# Altium schematic sheet Master MicroController Port C.SchDoc: Master Micro Controller Port C Pin Out
size A4; DocumentNumber: 18; SheetNumber: 18; SheetTotal: 54
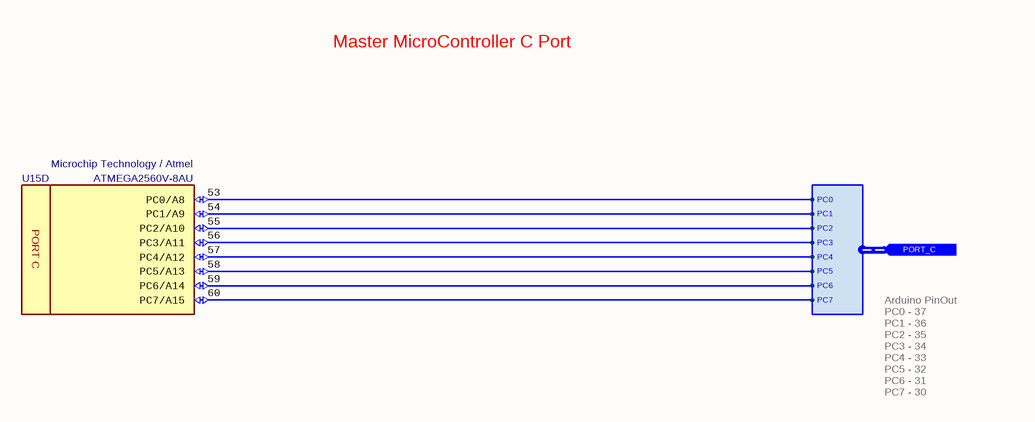
[diagram p0: Master MicroController Port C.SchDoc]

## Parts
U15  Manufacturer_Part_Number: ATMEGA2560V-8AU  Manufacturer_Name: Microchip Technology / Atmel  [TQFP100]  (hidden comment: 8-bit MicroController)  (part D of 15)

## Ports
PORT_C (in, harness PORT_C)

## Harnesses
PORT_C: PC0, PC1, PC2, PC3, PC4, PC5, PC7, PC6

## Nets
NetU15_53: U15.53(PC0/A8) ; port PORT_C.PC0
NetU15_54: U15.54(PC1/A9) ; port PORT_C.PC1
NetU15_55: U15.55(PC2/A10) ; port PORT_C.PC2
NetU15_56: U15.56(PC3/A11) ; port PORT_C.PC3
NetU15_57: U15.57(PC4/A12) ; port PORT_C.PC4
NetU15_58: U15.58(PC5/A13) ; port PORT_C.PC5
NetU15_59: U15.59(PC6/A14) ; port PORT_C.PC6
NetU15_60: U15.60(PC7/A15) ; port PORT_C.PC7

## Notes on the sheet
- Master MicroController C Port
- Arduino PinOut
  PC0 - 37
  PC1 - 36
  PC2 - 35
  PC3 - 34
  PC4 - 33
  PC5 - 32
  PC6 - 31
  PC7 - 30
- Engineer
- All Rights are reserved to Customer and Engineer. [2021]
- Size:
- Date:
- A4
- Project :
- Time:
- Sheet
- of
- Customer
- Product ID
- Module ID
- Version
- File:
- Revision
- (in symbol IC - ATMEGA2560V-8AU, part D) PORT C

## Library data of the parts
U15 = IC - ATMEGA2560V-8AU: 8-bit Microcontrollers - MCU 256kB Flash 4kB EEPROM 86 I/O Pins; Supply Voltage - Min: 2V7; Supply Voltage - Max: 5.5V; Height: 1mm; Mouser_Part_Number: 556-ATMEGA2560V8AU; ComponentLink1Description: DataSheet; ComponentLink1URL: https://eu.mouser.com/datasheet/2/268/Atmel-2549-8-bit-AVR-Microcontroller-ATmega640-128-1315286.pdf; ROHS: Yes; Minimum Operating Temperature: -40; Maximum Operating Temperature: +85; ComponentLink2Description: Mouser; ComponentLink2URL: https://eu.mouser.com/ProductDetail/Microchip-Technology-Atmel/ATMEGA2560V-8AU?qs=sGAEpiMZZMutXGli8Ay4kKlCYcvZUWqJYdtgGFyqFT8%3D; Supplier 1: Mouser; Supplier 2: Arrow; Supplier 3: Farnell; Supplier 4: Newark; Supplier 5: Digi-Key; Supplier Part Number 1: 556-ATMEGA2560V8AU; Supplier Part Number 2: ATMEGA2560V-8AU; Supplier Part Number 3: 1288331; Supplier Part Number 4: 68T2784; Supplier Part Number 5: ATMEGA2560V-8AU-ND; Case: TQFP-100